# EAGLE schematic Accumulator TS Internals (EAGLE 9.6.2)
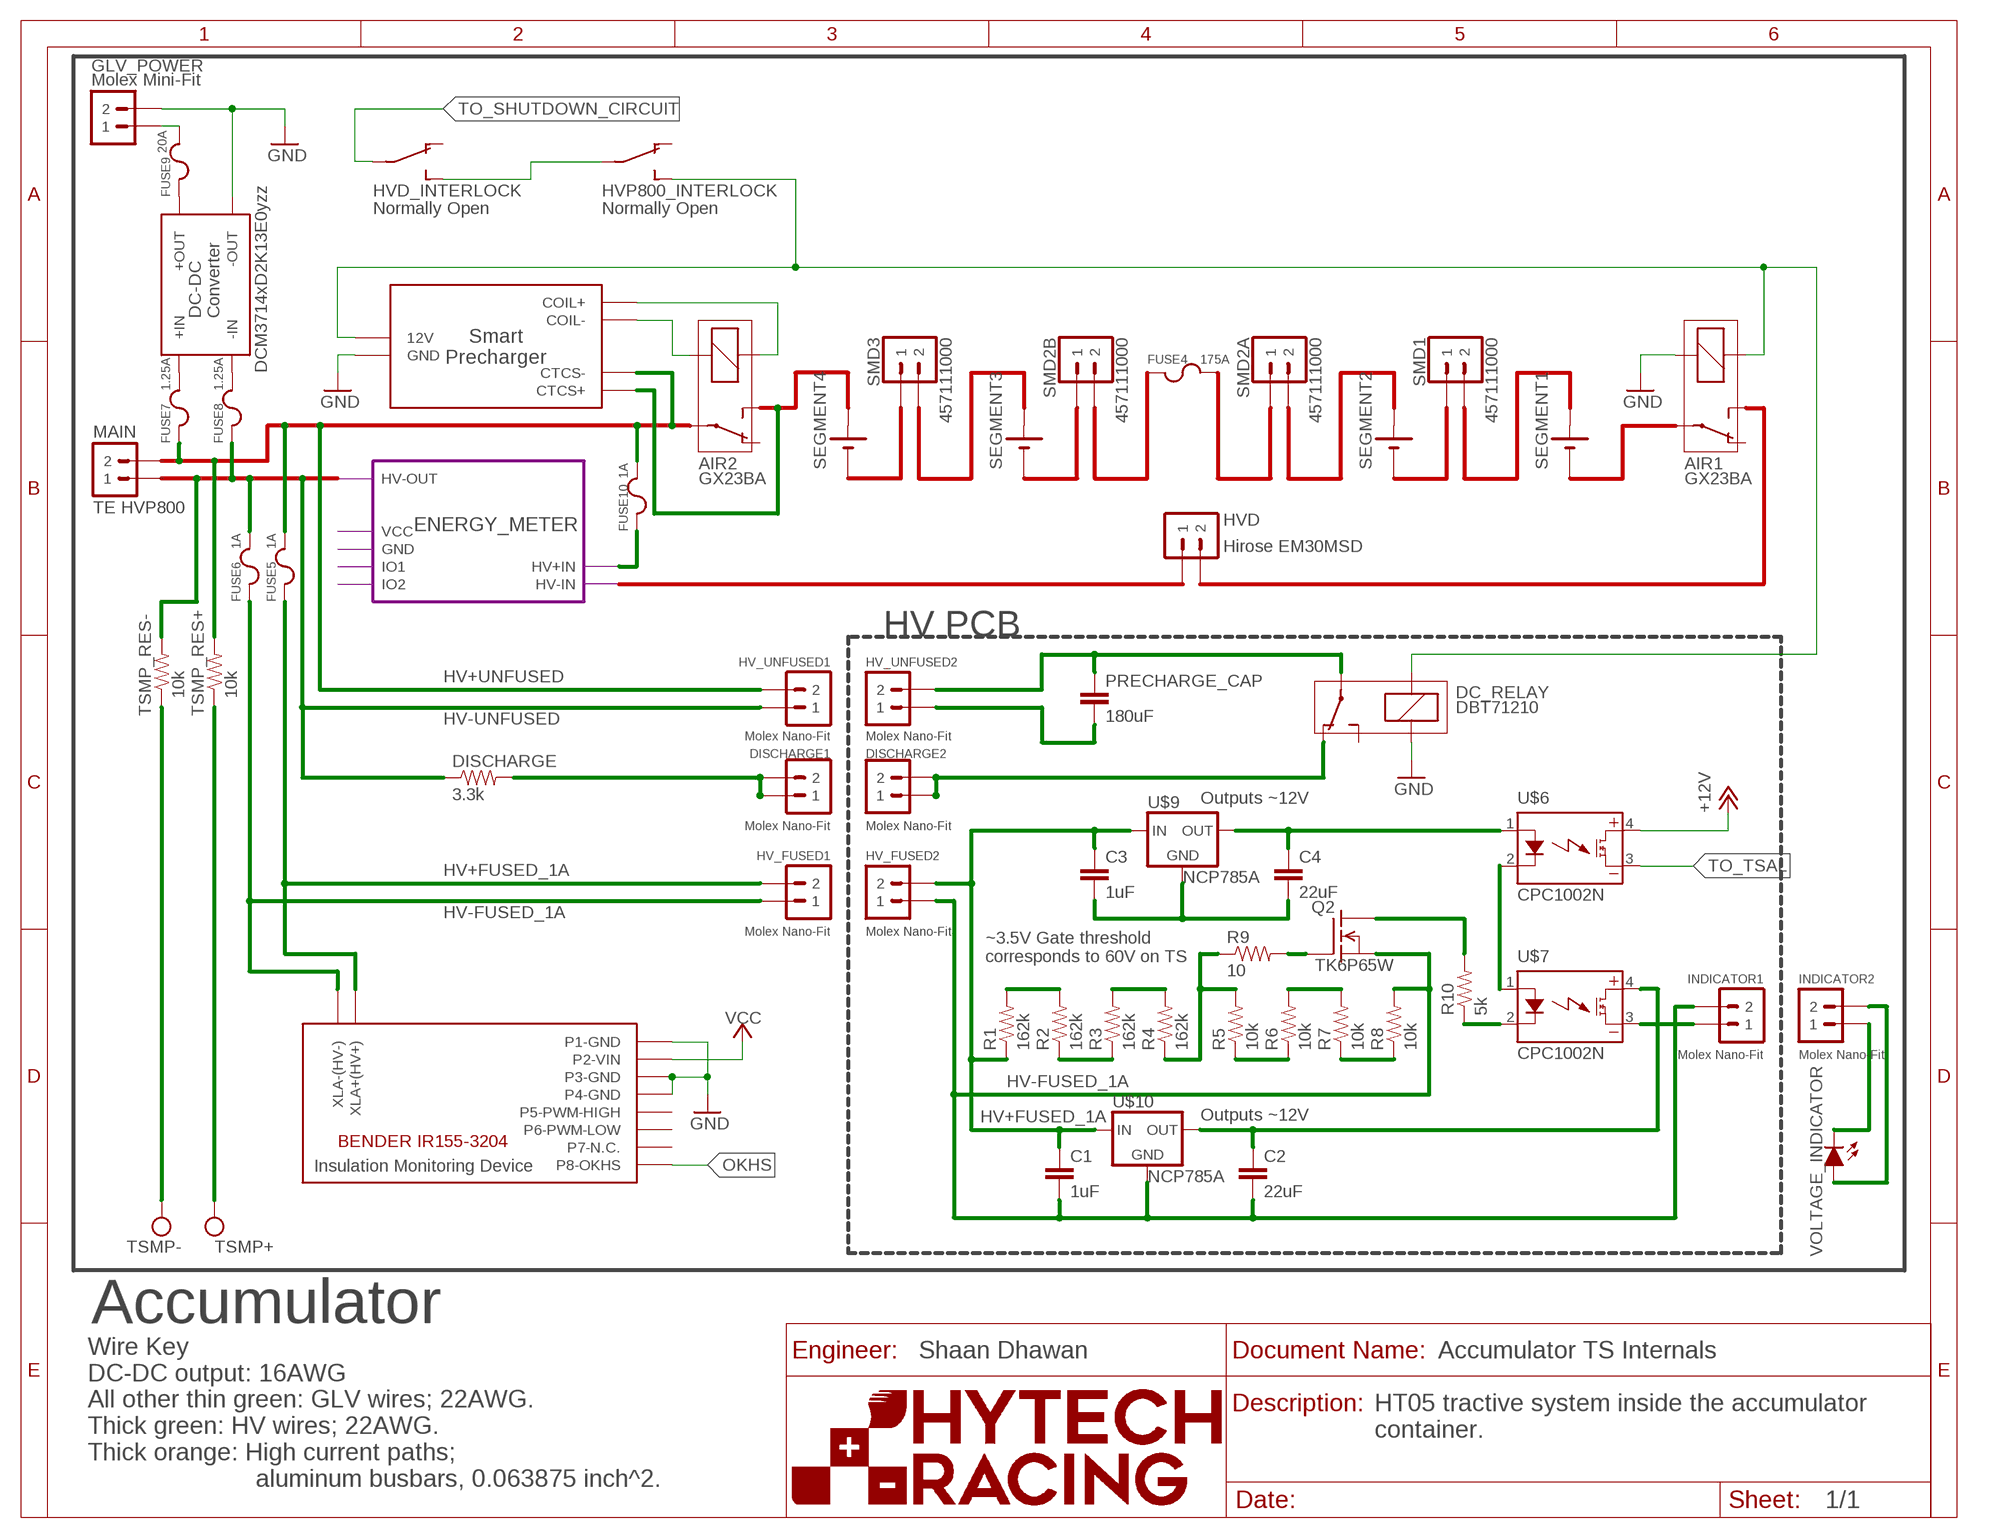
[diagram p0: schematic, sheet 1]
U$1 (FRAME_A_L): ORIENTATION: LANDSCAPE; SIZE: A

## Parts
AIR1  GX23BA  RELAY  (no package)
AIR2  GX23BA  RELAY  (no package)
C1  1uF  CAP0603-CAP  [0603-CAP]
C2  22uF  CAP0603-CAP  [0603-CAP]
C3  1uF  CAP0603-CAP  [0603-CAP]
C4  22uF  CAP0603-CAP  [0603-CAP]
DC_RELAY  DBT71210  RELAY  (no package)
DISCHARGE  3.3k  RESISTOR10W  [10W_RESISTOR_VISHAY]
DISCHARGE1  Molex Nano-Fit  M02  (no package)
DISCHARGE2  Molex Nano-Fit  M02  (no package)
FUSE4  175A  FUSE  (no package)
FUSE5  1A  FUSE  (no package)
FUSE6  1A  FUSE  (no package)
FUSE7  1.25A  FUSE  (no package)
FUSE8  1.25A  FUSE  (no package)
FUSE9  20A  FUSE  (no package)
FUSE10  1A  FUSE  (no package)
GLV_POWER  Molex Mini-Fit  M02  (no package)
HV_FUSED1  Molex Nano-Fit  M02  (no package)
HV_FUSED2  Molex Nano-Fit  M02  (no package)
HV_UNFUSED1  Molex Nano-Fit  M02  (no package)
HV_UNFUSED2  Molex Nano-Fit  M02  (no package)
HVD  Hirose EM30MSD  M02  (no package)
HVD_INTERLOCK  Normally Open  SWITCH_SPST  (no package)
HVP800_INTERLOCK  Normally Open  SWITCH_SPST  (no package)
INDICATOR1  Molex Nano-Fit  M02  (no package)
INDICATOR2  Molex Nano-Fit  M02  (no package)
MAIN  TE HVP800  M02  (no package)
PRECHARGE_CAP  180uF  CAPPTH3  [CAP-PTH-LARGE]
Q2  TK6P65W  DMG3406LSOT  [SOT23]
R1  162k  RESISTOR0603  [0603-RES]
R2  162k  RESISTOR0603  [0603-RES]
R3  162k  RESISTOR0603  [0603-RES]
R4  162k  RESISTOR0603  [0603-RES]
R5  10k  RESISTOR0603  [0603-RES]
R6  10k  RESISTOR0603  [0603-RES]
R7  10k  RESISTOR0603  [0603-RES]
R8  10k  RESISTOR0603  [0603-RES]
R9  10  RESISTOR0603  [0603-RES]
R10  5k  RESISTOR0603  [0603-RES]
SEGMENT1  BATTERY_1_CELL  (no package)
SEGMENT2  BATTERY_1_CELL  (no package)
SEGMENT3  BATTERY_1_CELL  (no package)
SEGMENT4  BATTERY_1_CELL  (no package)
SMD1  457111000  M02  (no package)
SMD2A  457111000  M02  (no package)
SMD2B  457111000  M02  (no package)
SMD3  457111000  M02  (no package)
TSMP_RES+  10k  RESISTOR10W  [10W_RESISTOR_VISHAY]
TSMP_RES-  10k  RESISTOR10W  [10W_RESISTOR_VISHAY]
U$2  TEST_POINT  [TEST_POINT]
U$3  TEST_POINT  [TEST_POINT]
U$4  SMART_PRECHARGER  (no package)
U$5  Insulation Monitoring Device  BENDER_IR155-3204  (no package)
U$6  CPC1002N  [SOP04]
U$7  CPC1002N  [SOP04]
U$8  DC-DC_CONVERTER  (no package)
U$9  NCP785A  (no package)
U$10  NCP785A  (no package)
VOLTAGE_INDICATOR  LED  (no package)

## Module instances
ENERGY_METER = ENERGY_METER

## Nets
+12V: U$6.4(DC+)
GND: AIR1.2 DC_RELAY.1 GLV_POWER.2 U$4.GND U$5.P1-GND U$5.P3-GND U$5.P4-GND U$8.-OUT
HV+FUSED_1A [TS]: C1.1 C3.1 FUSE5.1 HV_FUSED1.2 HV_FUSED2.2 R1.1 U$5.XLA+(HV+) U$9.IN U$10.IN
HV+UNFUSED: HV_UNFUSED1.2
HV-FUSED_1A [TS]: C1.2 C2.2 FUSE6.1 HV_FUSED1.1 HV_FUSED2.1 INDICATOR1.2 Q2.2(S) R8.2 U$5.XLA-(HV-) U$10.GND
HV-FUSED_1A1 [TS]: C3.2 C4.2 U$9.GND
HV-UNFUSED: HV_UNFUSED1.1
N$1: C4.1 U$6.1(CONTROL+) U$9.OUT
N$2: R1.2 R2.2
N$3: R2.1 R3.1
N$4: R3.2 R4.2
N$5: DISCHARGE1.1 DISCHARGE1.2
N$6: AIR1.1 DC_RELAY.2 HVP800_INTERLOCK.S U$4.12V
N$7: FUSE8.1
N$8: TSMP_RES+.1 U$2.P$1
N$9: FUSE10.1 ; port ENERGY_METER.HV+IN
N$10: AIR2.2 U$4.COIL-
N$11: AIR2.1 U$4.COIL+
N$12: FUSE10.2
N$13: FUSE5.2
N$14: R4.1 R5.2 R9.1
N$15: R5.1 R6.1
N$16: R6.2 R7.2
N$17: DC_RELAY.O DISCHARGE2.1 DISCHARGE2.2
N$18: DISCHARGE.2
N$19: DC_RELAY.P HV_UNFUSED2.2 PRECHARGE_CAP.1
N$20: FUSE6.2
N$21: TSMP_RES-.1 U$3.P$1
N$22: HV_UNFUSED2.1 PRECHARGE_CAP.2
N$23: U$4.CTCS+
N$24: C2.1 U$7.4(DC+) U$10.OUT
N$25: U$4.CTCS-
N$26: TSMP_RES+.2
N$27: TSMP_RES-.2
N$28: DISCHARGE.1
N$29: INDICATOR2.1 VOLTAGE_INDICATOR.C
N$30: INDICATOR2.2 VOLTAGE_INDICATOR.A
N$31: R7.1 R8.1
N$32: Q2.1(G) R9.2
N$33: U$6.2(CONTROL-) U$7.1(CONTROL+)
N$34: Q2.3(D) R10.2
N$35: R10.1 U$7.2(CONTROL-)
N$36: INDICATOR1.1 U$7.3(DC-)
N$37: HVD_INTERLOCK.S HVP800_INTERLOCK.P
N$38: FUSE7.1
N$39: FUSE9.2 GLV_POWER.1
N$41: FUSE7.2 U$8.+IN
N$42: FUSE8.2 U$8.-IN
N$43: FUSE9.1 U$8.+OUT
OKHS: U$5.P8-OKHS
TO_SHUTDOWN_CIRCUIT: HVD_INTERLOCK.P
TO_TSAL: U$6.3(DC-)
VCC: U$5.P2-VIN
Unconnected: AIR1.O AIR1.P AIR1.S AIR2.O AIR2.P AIR2.S DC_RELAY.S FUSE4.1 FUSE4.2 HVD.1 HVD.2 HVD_INTERLOCK.O HVP800_INTERLOCK.O MAIN.1 MAIN.2 SEGMENT1.+ SEGMENT1.- SEGMENT2.+ SEGMENT2.- SEGMENT3.+ SEGMENT3.- SEGMENT4.+ SEGMENT4.- SMD1.1 SMD1.2 SMD2A.1 SMD2A.2 SMD2B.1 SMD2B.2 SMD3.1 SMD3.2 U$5.P5-PWM-HIGH U$5.P6-PWM-LOW U$5.P7-N.C.

## Notes on the sheet
- DCM3714xD2K13E0yzz
- HV PCB
- Outputs ~12V
- ~3.5V Gate threshold
  corresponds to 60V on TS
- Outputs ~12V
- Insulation Monitoring Device
- TSMP- | TSMP+
- Accumulator
- Shaan Dhawan
- HT05 tractive system inside the accumulator 
  container.
- Wire Key
  DC-DC output: 16AWG
  All other thin green: GLV wires; 22AWG.
  Thick green: HV wires; 22AWG.
  Thick orange: High current paths; 
                          aluminum busbars, 0.063875 inch^2.

## Library data of the parts
AIR1 AIR2 DC_RELAY = HyTechSymbols:RELAY: RELAY 1 x switch
C1-C4 PRECHARGE_CAP = HyTechDevices:CAP: Capacitor Standard 0603 ceramic capacitor, and 0.1" leaded capacitor.
DISCHARGE R1-R10 TSMP_RES+ TSMP_RES- = HyTechDevices:RESISTOR: Resistor Basic schematic elements and footprints for 0603, 1206, and PTH resistors.
DISCHARGE1 DISCHARGE2 GLV_POWER HV_FUSED1 HV_FUSED2 HV_UNFUSED1 HV_UNFUSED2 HVD INDICATOR1 INDICATOR2 MAIN SMD1 SMD2A SMD2B SMD3 = HyTechSymbols:M02: Generic 2-pin connector
FUSE4-FUSE10 = HyTechSymbols:FUSE: Generic Fuse
HVD_INTERLOCK HVP800_INTERLOCK = HyTechSymbols:SWITCH_SPST: Single Pull Single Throw Switch
Q2 = HyTechDevices:DMG3406L: Generic NPN MOSFET DMG3406L (SOT-23, 2.8 A 30V)
SEGMENT1-SEGMENT4 = HyTechSymbols:BATTERY_1_CELL: Generic 1-cell battery Source: Sonnenschein
U$2 U$3 = HyTechDevices:TEST_POINT: Keystone Electronics Test Point 5005
U$4 = HyTechSymbols:SMART_PRECHARGER: Smart Precharger http://www.zeva.com.au/Products/datasheets/SmartPrechargerV1-3.pdf
U$5 = HyTechSymbols:BENDER_IR155-3204: Bender IR155-3204 Insulation Monitoring Device Datasheet <http://www.bender-es.com/fileadmin/products/doc/IR155-32xx-V004_D00115_D_XXEN.pdf>
U$6 U$7 = HyTechDevices:CPC1002N: IXYS Solid State Relay .7A
U$8 = HyTechSymbols:DC-DC_CONVERTER
U$9 U$10 = HyTechDevices:NCP785A
VOLTAGE_INDICATOR = HyTechSymbols:LED: Generic LED

## Module ENERGY_METER
Ports: HV+IN(in) HV-OUT(in) HV-IN(out) VCC(in) GND(out) IO1(io) IO2(io)

### Library data of the parts

## Net classes
1 TS: clearance 2.25 mm to class 0